# Altium schematic sheet I2C_Buffer.SchDoc
size 297 x 209 mm; SheetNumber: 5; SheetTotal: 11
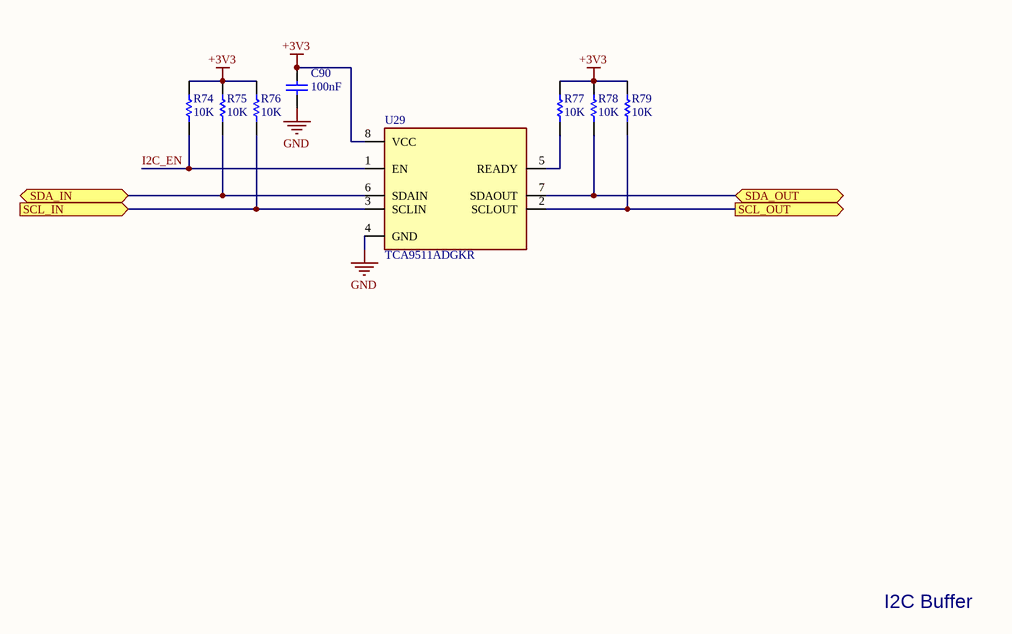
[diagram p0: I2C_Buffer.SchDoc]

## Parts
C90  Capacitance: 100nF  [CAPC0603X040]  (hidden comment: C0603C104K5RACTU)
R74  Resistance: 10K  [RESC0603]  (hidden comment: RMCF0603FT10K0)
R75  Resistance: 10K  [RESC0603]  (hidden comment: RMCF0603FT10K0)
R76  Resistance: 10K  [RESC0603]  (hidden comment: RMCF0603FT10K0)
R77  Resistance: 10K  [RESC0603]  (hidden comment: RMCF0603FT10K0)
R78  Resistance: 10K  [RESC0603]  (hidden comment: RMCF0603FT10K0)
R79  Resistance: 10K  [RESC0603]  (hidden comment: RMCF0603FT10K0)
U29  TCA9511ADGKR  [VSSOP-8]

## Ports
SCL_IN (in, see Controller[2D]), SCL_OUT (out, see Controller[2D]), SDA_IN (bidir, see Controller[2D]), SDA_OUT (bidir, see Controller[2D])

## Nets
+3V3: C90.2 R74.2 R75.2 R76.2 R77.2 R78.2 R79.2 U29.8(VCC)
GND: C90.1 U29.4(GND)
I2C_EN: R74.1 U29.1(EN)
SCL_IN: R76.1 U29.3(SCLIN) ; port SCL_IN
SCL_OUT: R79.1 U29.2(SCLOUT) ; port SCL_OUT
SDA_IN: R75.1 U29.6(SDAIN) ; port SDA_IN
SDA_OUT: R78.1 U29.7(SDAOUT) ; port SDA_OUT
NetR77_1: R77.1 U29.5(READY)

## Notes on the sheet
- I2C Buffer
- Size:
- Title:
- A4
- Project:
- Rev:
- Date:
- Drawn By:
- Sheet:
- of

## Library data of the parts
C90 = C0603C104K5RACTU: 0.1 µF ±10% 50V Ceramic Capacitor X7R 0603 (1608 Metric); Tolerance: 10%; Distributor Part Number: 399-C0603C104K5RACTUCT-ND; Case Code: 0603; Voltage Rating: 50V; Distributor: Digikey; Part Number: C0603C104K5RACTU
R74-R79 = RMCF0603FT10K0: 10 kOhms ±1% 0.1W, 1/10W Chip Resistor 0603 (1608 Metric) Automotive AEC-Q200 Thick Film; Part Number: RMCF0603FT10K0; Tolerance: 1%; Distributor: Digikey; Distributor Part Number: RMCF0603FT10K0CT-ND; Case Code: 0603
U29 = TCA9511ADGKR: Hot-swappable, bidirectional I²C/SMBus bus buffer, 1 V precharge, standard/fast I²C, clock stretching, arbitration, and powered-off high-impedance on bus pins.; Delay Time: 70ns; Part Number: TCA9511ADGKR; Distributor: Digikey; Distributor Part Number: 296-TCA9511ADGKRCT-ND; Operating Temperature: -40°C ~ 125°C